# Altium schematic sheet LEDStrip.SchDoc
size A
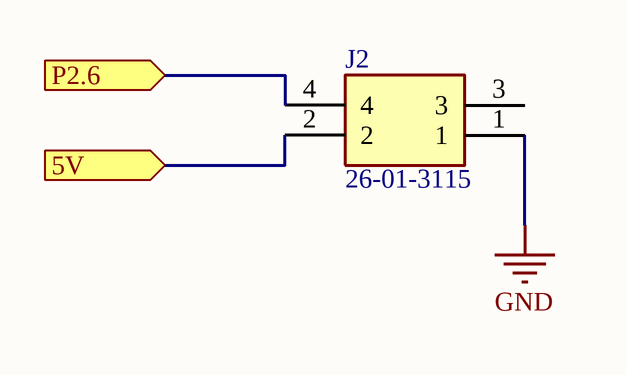
[diagram p0: LEDStrip.SchDoc]

## Parts
J2  26-01-3115  [26013115]

## Ports
5V (in), P2.6 (in)

## Nets
GND: J2.1
5V: J2.2 ; port 5V
P2.6: J2.4 ; port P2.6

Not connected (* = marked no-connect by the designer): J2 3

## Library data of the parts
J2 = 26-01-3115: Connector; Manufacturer_Name: Molex; Datasheet Link: https://componentsearchengine.com//26-01-3115.pdf; Height: 10mm; Mouser2 Part Number: 538-26-01-3115; Mouser2 Price/Stock: https://www.mouser.com/Search/Refine.aspx?Keyword=538-26-01-3115; Manufacturer_Part_Number: 26-01-3115